# EAGLE design CortexM0 development board (EAGLE 9.6.2)
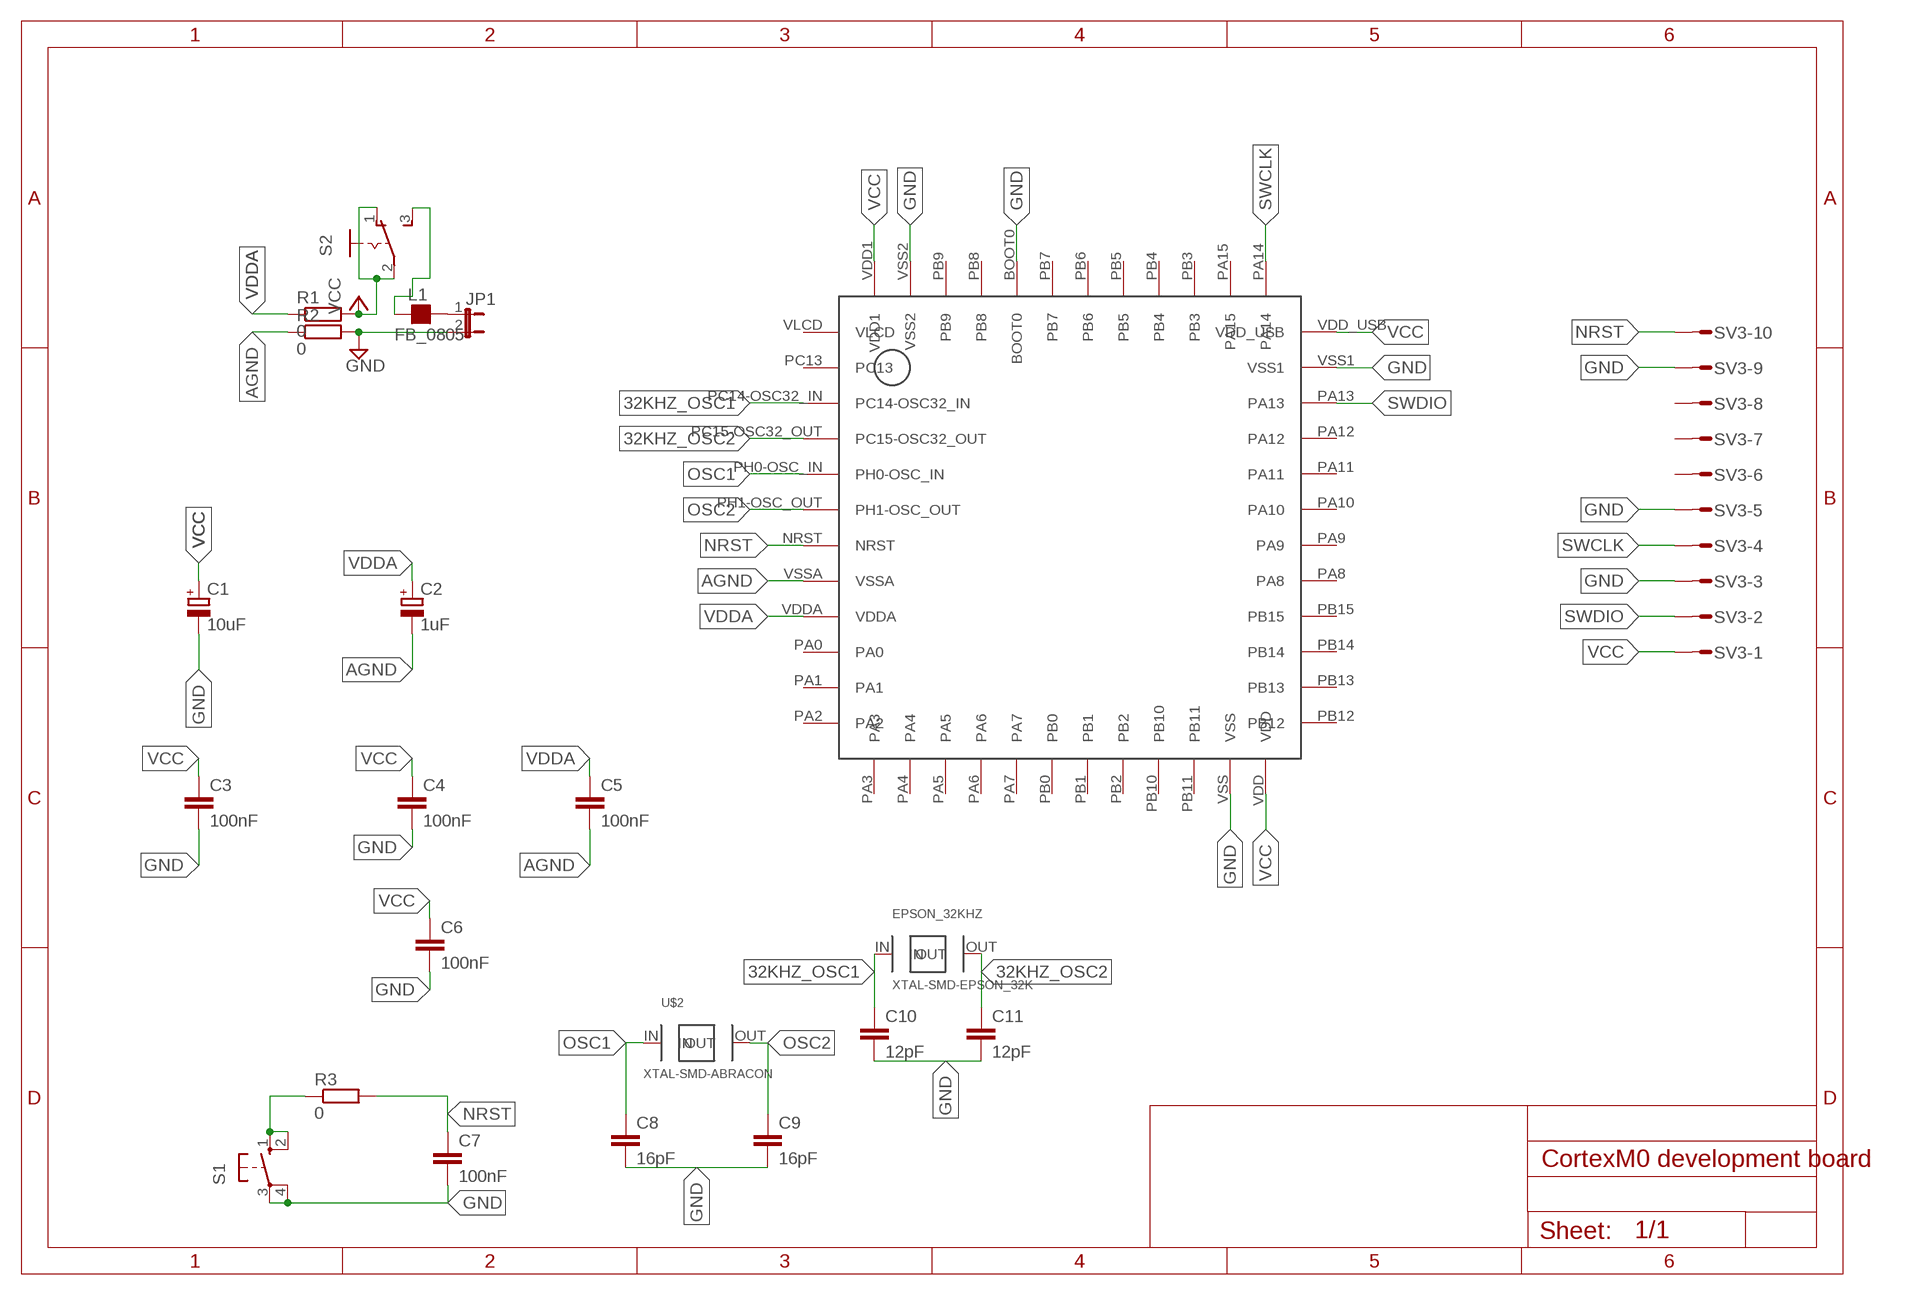
[diagram p0: schematic, sheet 1]

## Parts
C1  10uF  CPOL-EUB  [PANASONIC_B]
C2  1uF  CPOL-EUB  [PANASONIC_B]
C3  100nF  C-EUC0805  [C0805]
C4  100nF  C-EUC0805  [C0805]
C5  100nF  C-EUC0805  [C0805]
C6  100nF  C-EUC0805  [C0805]
C7  100nF  C-EUC0805  [C0805]
C8  16pF  C-EUC0805  [C0805]
C9  16pF  C-EUC0805  [C0805]
C10  12pF  C-EUC0805  [C0805]
C11  12pF  C-EUC0805  [C0805]
EPSON_32KHZ  XTAL-SMD-EPSON_32K  [XTAL-EPSON-FC135R]
JP1  JP1E  [JP1]
L1  FB_0805  [L0805]
R1  0  R-EU_R0805  [R0805]
R2  0  R-EU_R0805  [R0805]
R3  0  R-EU_R0805  [R0805]
S1  10-XX  [B3F-10XX]
S2  255SB  [255SB]
SV3  S10P  [S10P]
U$1  STM32L083-LQFP48  [LQFP_48]
U$2  XTAL-SMD-ABRACON  [XTAL-SMD-ABRACON]

## Nets
32KHZ_OSC1: C10.1 EPSON_32KHZ.IN U$1.PC14-OSC32_IN
32KHZ_OSC2: C11.1 EPSON_32KHZ.OUT U$1.PC15-OSC32_OUT
AGND: C2.- C5.2 R2.1 U$1.VSSA
GND: C1.- C3.2 C4.2 C6.2 C7.2 C8.2 C9.2 C10.2 C11.2 JP1.2 R2.2 S1.3(P) S1.4(P1) SV3.3 SV3.5 SV3.9 U$1.BOOT0 U$1.VSS U$1.VSS1 U$1.VSS2
N$1: JP1.1 L1.2
N$2: R3.1 S1.1(S) S1.2(S1)
N$3: L1.1 S2.3(S)
NRST: C7.1 R3.2 SV3.10 U$1.NRST
OSC1: C8.1 U$1.PH0-OSC_IN U$2.IN
OSC2: C9.1 U$1.PH1-OSC_OUT U$2.OUT
SWCLK: SV3.4 U$1.PA14
SWDIO: SV3.2 U$1.PA13
VCC: C1.+ C3.1 C4.1 C6.1 R1.2 S2.1(O) S2.2(P) SV3.1 U$1.VDD U$1.VDD1 U$1.VDD_USB
VDDA: C2.+ C5.1 R1.1 U$1.VDDA
Unconnected: SV3.6 SV3.7 SV3.8 U$1.PA0 U$1.PA1 U$1.PA2 U$1.PA3 U$1.PA4 U$1.PA5 U$1.PA6 U$1.PA7 U$1.PA8 U$1.PA9 U$1.PA10 U$1.PA11 U$1.PA12 U$1.PA15 U$1.PB0 U$1.PB1 U$1.PB2 U$1.PB3 U$1.PB4 U$1.PB5 U$1.PB6 U$1.PB7 U$1.PB8 U$1.PB9 U$1.PB10 U$1.PB11 U$1.PB12 U$1.PB13 U$1.PB14 U$1.PB15 U$1.PC13 U$1.VLCD

## Library data of the parts
C1 C2 = rcl:CPOL-EU: POLARIZED CAPACITOR, European symbol; SPICEPREFIX: C
C3-C11 = rcl:C-EU: CAPACITOR, European symbol; SPICEPREFIX: C
EPSON_32KHZ = BHARADWAJ-XTAL:XTAL-SMD-EPSON_32K
JP1 = jumper:JP1E: JUMPER
L1 = rc-master:FB_: FERRITE BEAD
R1-R3 = rcl:R-EU_: RESISTOR, European symbol; SPICEPREFIX: R
S1 = switch-omron:10-XX: OMRON SWITCH; MPN: B3F-1000; OC_FARNELL: 176432; OC_NEWARK: 36M3542
S2 = switch:255SB: SLIDING SWITCH Distributor Buerklin, 11G810
SV3 = con-amp-mt:S10P: AMP MT CONNECTOR; OC_FARNELL: unknown; OC_NEWARK: unknown
U$1 = BHARADWAJ-STM32L083:STM32L083-LQFP48
U$2 = BHARADWAJ-XTAL:XTAL-SMD-ABRACON

## Board
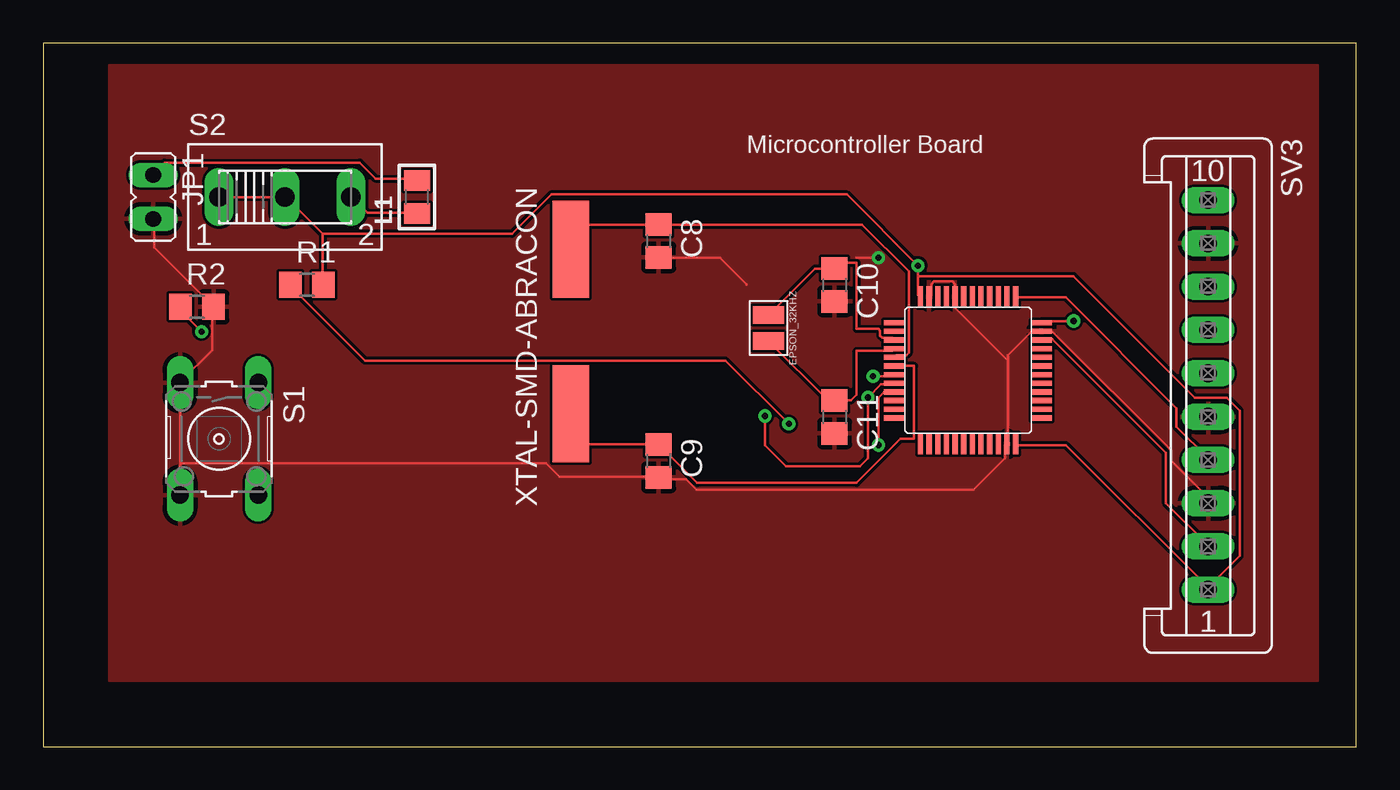
[diagram p1: board, top side]
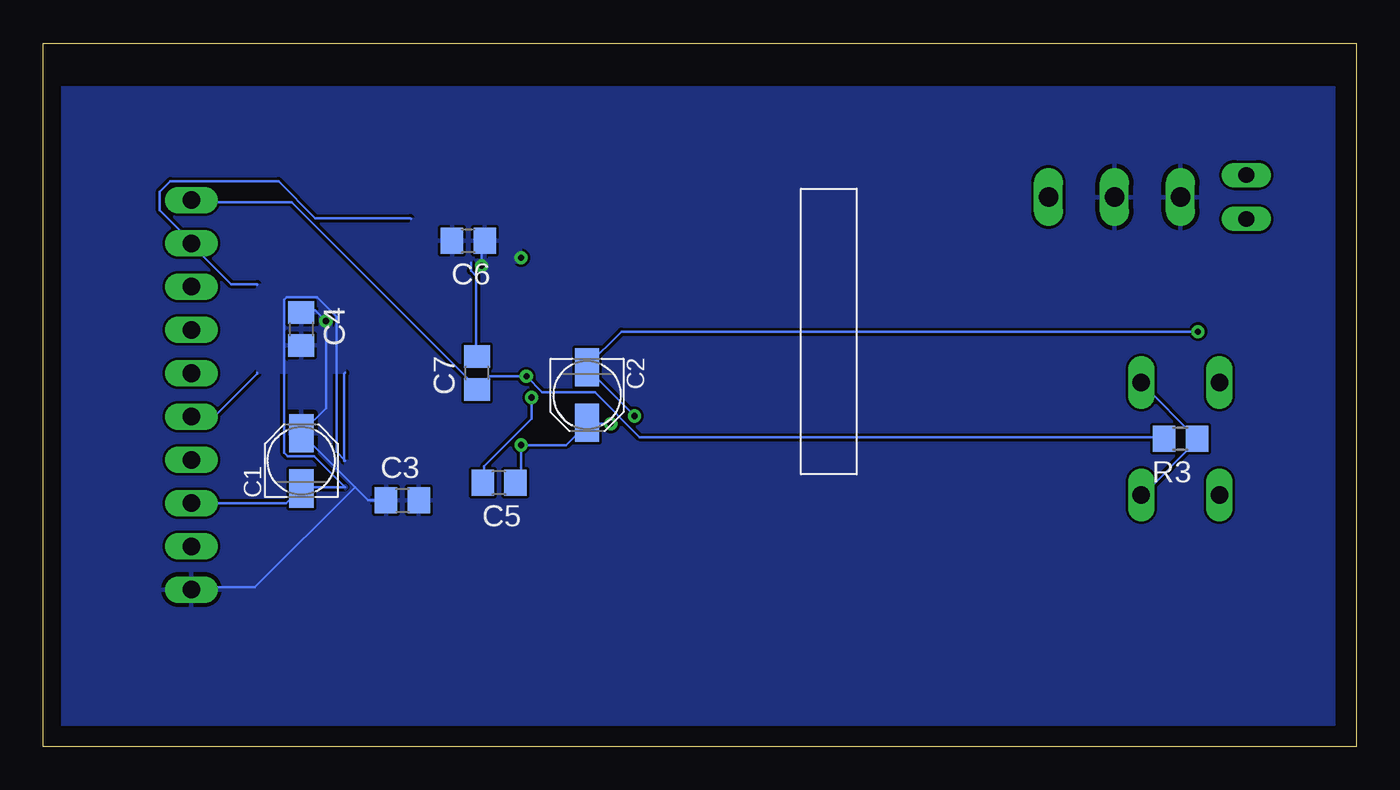
[diagram p2: board, bottom side, seen from below]

Size 75.87 x 40.63 mm. Coordinates in mm from the lower left corner, seen from the top.
Outline: 0,0 75.87,0 75.87,40.63 0,40.63 0,0
Copper layers (1*16): Top 0.035mm / dielectric 1.5mm / Bottom 0.035mm
Design rules "default": minimum track width 6mil, minimum drill 0.35mm, track to track 6mil, track to pad 6mil, pad to pad 6mil, via to via 6mil, smd to smd 6mil, copper to edge 40mil, drill to drill 6mil, minimum pad ring 10mil, minimum via ring 8mil, stop-mask expansion 4mil, vias tented up to drill 0mil, thermal gap 10mil

### Footprints (pad centres in the part's own frame; a part is rotated, then mirrored left to right if it is on the bottom)
PANASONIC_B = smd 2.2 x 1.4: + 1.6,0; - -1.6,0
C0805 = smd 1.3 x 1.5: 1 -0.95,0; 2 0.95,0
XTAL-EPSON-FC135R = smd 1 x 1.8: IN -0.8,0; OUT 0.7,0
JP1 = drill 0.914 long: 1 0,-1.27; 2 0,1.27
L0805 = smd 1.2 x 1.5: 1 -0.953,0; 2 0.953,0
R0805 = smd 1.3 x 1.5: 1 -0.95,0; 2 0.95,0
B3F-10XX = drill 1.016 long: 1 -3.251,2.261; 2 3.251,2.261; 3 -3.251,-2.261; 4 3.251,-2.261
255SB = drill 1.118 long: 1 -3.81,0; 2 0,0; 3 3.81,0
S10P = drill 1.016 long: 1 11.25,0; 2 8.75,0; 3 6.25,0; 4 3.75,0; 5 1.25,0; 6 -1.25,0; 7 -3.75,0; 8 -6.25,0; 9 -8.75,0; 10 -11.25,0
LQFP_48 = smd 0.3 x 1.2: BOOT0 -0.65,4.4; PA3 -2.65,-4.1; PA4 -2.15,-4.1; PA5 -1.65,-4.1; PA6 -1.15,-4.1; PA7 -0.65,-4.1; PA14 2.85,4.4; PA15 2.35,4.4; PB0 -0.15,-4.1; PB1 0.35,-4.1; PB2 0.85,-4.1; PB3 1.85,4.4; PB4 1.35,4.4; PB5 0.85,4.4; PB6 0.35,4.4; PB7 -0.15,4.4; PB8 -1.15,4.4; PB9 -1.65,4.4; PB10 1.35,-4.1; PB11 1.85,-4.1; VDD 2.85,-4.1; VDD1 -2.65,4.4; VSS 2.35,-4.1; VSS2 -2.15,4.4 | smd 1.2 x 0.3: NRST -4.15,-0.1; PA0 -4.15,-1.6; PA1 -4.15,-2.1; PA2 -4.15,-2.6; PA8 4.35,-0.6; PA9 4.35,-0.1; PA10 4.35,0.4; PA11 4.35,0.9; PA12 4.35,1.4; PA13 4.35,1.9; PB12 4.35,-2.6; PB13 4.35,-2.1; PB14 4.35,-1.6; PB15 4.35,-1.1; PC13 -4.15,2.4; PC14-OSC32_IN -4.15,1.9; PC15-OSC32_OUT -4.15,1.4; PH0-OSC_IN -4.15,0.9; PH1-OSC_OUT -4.15,0.4; VDD_USB 4.35,2.9; VDDA -4.15,-1.1; VLCD -4.15,2.9; VSS1 4.35,2.4; VSSA -4.15,-0.6
XTAL-SMD-ABRACON = smd 5.6 x 2.1: IN -4.6,0; OUT 4.9,0

### Placement (x,y rotation side)
C1  60.96,16.51 90 bottom
C2  44.45,20.32 270 bottom
C3  55.12,14.22 0 bottom
C4  60.96,24.13 270 bottom
C5  49.53,15.24 180 bottom
C6  51.31,29.21 180 bottom
C7  50.8,21.59 90 bottom
C8  35.56,29.21 270 top
C9  35.56,16.51 270 top
C10  45.72,26.67 270 top
C11  45.72,19.05 270 top
EPSON_32KHZ  41.91,24.13 270 top
JP1  6.35,31.75 180 top
L1  21.59,31.75 90 top
R1  15.24,26.67 0 top
R2  8.89,25.4 0 top
R3  10.16,17.78 180 bottom
S1  10.16,17.78 270 top
S2  13.97,31.75 0 top
SV3  67.31,20.32 270 top
U$1  53.34,21.59 0 top
U$2  30.48,24.13 270 top

### Tracks (layer width: path | path; a pad name or v marks a point on that pad's centre or on a via)
32KHZ_OSC1
  Top 0.152: U$1.PC14-OSC32_IN 49.07,23.61 48.5,23.61 48.36,23.74 48.36,24.03 48.26,24.13 46.99,24.13 46.99,27.94 46.04,27.94 C10.1 44.6,27.62 EPSON_32KHZ.IN
32KHZ_OSC2
  Top 0.152: U$1.PC15-OSC32_OUT 49.07,22.87 48.5,22.87 48.49,22.86 46.99,22.86 46.99,20.32 46.67,20 C11.1 45.34,20 EPSON_32KHZ.OUT
AGND  (via drill 0.35)
  Top 0.152: U$1.VSSA 49.17,20.93 48.41,20.93 v47.65,20.17 47.65,16.66 47.19,16.2 42.93,16.2 41.71,17.42 v41.71,19.1 | v9.14,23.98 8.08,25.04 8.08,25.35 R2.1
  Bottom 0.152: v47.65,20.17 47.65,18.95 50.39,16.2 50.39,15.29 C5.2 | v9.14,23.98 42.47,23.98 44.45,22 C2.- 44.45,21.84 v41.71,19.1
GND  (via drill 0.35)
  Top 0.152: C8.2 35.61,28.24 39.12,28.24 40.64,26.72 40.64,26.67 | v48.26,28.24 46.99,28.24 | JP1.2 6.4,30.38 6.4,28.85 9.75,25.5 R2.2 9.75,25.35 9.75,22.91 7.93,21.08 S1.3 7.93,20.93 7.93,16.36 | 7.93,16.36 7.93,14.53 S1.4 | U$1.VSS2 51.31,26.11 51.31,26.72 51.46,26.87 52.53,26.87 52.68,26.72 52.68,26.11 U$1.BOOT0 52.68,25.96 52.68,25.35 55.73,22.3 | 55.73,22.3 55.73,22.61 57.1,23.98 57.56,23.98 U$1.VSS1 57.71,23.98 58.32,23.98 65.18,17.12 65.18,16.51 67.31,14.38 SV3.3 | 55.73,22.3 55.73,17.58 U$1.VSS 55.58,17.42 55.58,16.66 53.75,14.83 37.74,14.83 37.14,15.44 35.61,15.44 C9.2 35.46,15.6 29.82,15.6 29.06,16.36 7.93,16.36
  Bottom 0.152: 58.42,21.59 58.47,21.54 58.47,16.51 58.42,16.51 58.93,17.02 58.93,24.84 60.05,25.96 61.81,25.96 61.94,25.82 61.94,16.96 61.76,16.78 60.22,16.78 58.42,14.99 60.91,14.99 C1.- 61.06,14.83 61.82,14.07 SV3.3 | SV3.5 67.31,19.1 65.94,19.1 63.5,21.54 63.5,21.59 | 51.16,27.94 51.16,27.48 50.85,27.18 50.85,22.61 C7.2 | 54.61,30.48 54.66,30.53 60.15,30.53 62.28,32.66 68.53,32.66 69.14,32.05 69.14,30.99 67.31,29.16 SV3.9 67.31,29.01 65.02,26.72 63.5,26.72 63.5,26.67
  pour Top: 40.64,26.67 40.64,21.59 43.18,21.59 43.18,16.51 46.99,16.51 46.99,29.21 43.18,29.21 43.18,26.67
  pour Bottom: 48.26,30.48 48.26,27.94 54.61,27.94 54.61,30.48
  pour Bottom: 58.42,26.67 58.42,21.59 63.5,21.59 63.5,26.67
  pour Bottom: 52.07,16.51 52.07,12.7 58.42,12.7 58.42,16.51
  pour Top: 26.67,30.48 29.21,33.02 36.83,33.02 38.1,31.75 38.1,30.48 38.1,27.94 36.83,26.67 33.02,26.67 33.02,19.05 36.83,19.05 38.1,17.78 38.1,15.24 36.83,13.97 29.21,13.97 26.67,16.51
  pour Top: 3.81,39.37 3.81,3.81 73.66,3.81 73.66,39.37
N$1
  Top 0.152: L1.2 21.49,32.82 19.2,32.82 18.29,33.73 7.01,33.73 6.4,33.12 JP1.1
N$2
  Bottom 0.152: S1.1 12.34,20.93 9.3,17.88 R3.1 9.14,17.73 12.34,14.53 S1.2
N$3
  Top 0.152: L1.1 21.49,30.84 18.75,30.84 17.83,31.75 S2.3
NRST  (via drill 0.35)
  Top 0.152: v47.95,21.39 49.17,21.39 U$1.NRST
  Bottom 0.152: R3.2 11.13,17.88 41.4,17.88 43.99,20.47 47.04,20.47 v47.95,21.39 50.09,21.39 50.7,20.78 C7.1 50.85,20.78 61.52,31.45 67.31,31.45 SV3.10
OSC1
  Top 0.152: U$1.PH0-OSC_IN 49.31,22.61 49.89,22.61 50.02,22.74 50.02,27.45 47.31,30.16 C8.1 30.48,30.16 U$2.IN
OSC2
  Top 0.152: U$1.PH1-OSC_OUT 50.31,21.99 50.31,17.78 49.53,17.78 46.99,15.24 37.78,15.24 C9.1 30.48,17.46 U$2.OUT
SWCLK
  Top 0.152: U$1.PA14 56.34,25.96 59.08,25.96 65.48,19.56 65.48,18.49 67.31,16.66 SV3.4
SWDIO
  Top 0.152: U$1.PA13 57.71,23.52 58.32,23.52 64.87,16.97 64.87,14.07 67.31,11.63 SV3.2
VCC  (via drill 0.35)
  Top 0.152: v59.54,24.59 57.71,24.59 U$1.VDD_USB | 16.15,29.62 16.15,26.72 R1.2 | 16.15,29.62 14.02,31.75 S2.2 S2.1 | 50.55,27.18 v50.55,27.79 46.43,31.9 29.36,31.9 27.08,29.62 16.15,29.62 | 50.55,27.18 50.55,26.11 U$1.VDD1 | 67.31,9.2 59.08,17.42 56.34,17.42 U$1.VDD | 50.55,27.18 59.54,27.18 66.55,20.17 68.38,20.17 69.14,19.41 69.14,11.02 67.31,9.2 | 67.31,9.2 SV3.1
  Bottom 0.152: C4.1 60.91,25.2 60.15,25.2 v59.54,24.59 59.54,19.56 60.91,18.19 C1.+ 60.91,18.03 57.86,14.99 | C3.1 57.1,14.22 57.86,14.99 | v50.55,27.79 50.55,29.01 50.39,29.16 C6.1 | 57.86,14.99 63.65,9.2 67.31,9.2 SV3.1
  pour Bottom: 1.27,38.1 1.27,1.27 74.93,1.27 74.93,38.1
VDDA  (via drill 0.35)
  Top 0.152: v48.26,17.42 48.26,20.17 48.56,20.47 49.17,20.47 U$1.VDDA | v43.08,18.64 39.42,22.3 18.59,22.3 14.33,26.57 R1.1
  Bottom 0.152: C5.1 48.56,15.29 48.26,15.6 v48.26,17.42 45.67,17.42 44.45,18.64 | 44.45,18.64 v43.08,18.64 | 44.45,18.64 C2.+

### Text on the board
tNames: Microcontroller Board